# EAGLE schematic sample2 (EAGLE 9.5.0)

## Sheet 1 of 3
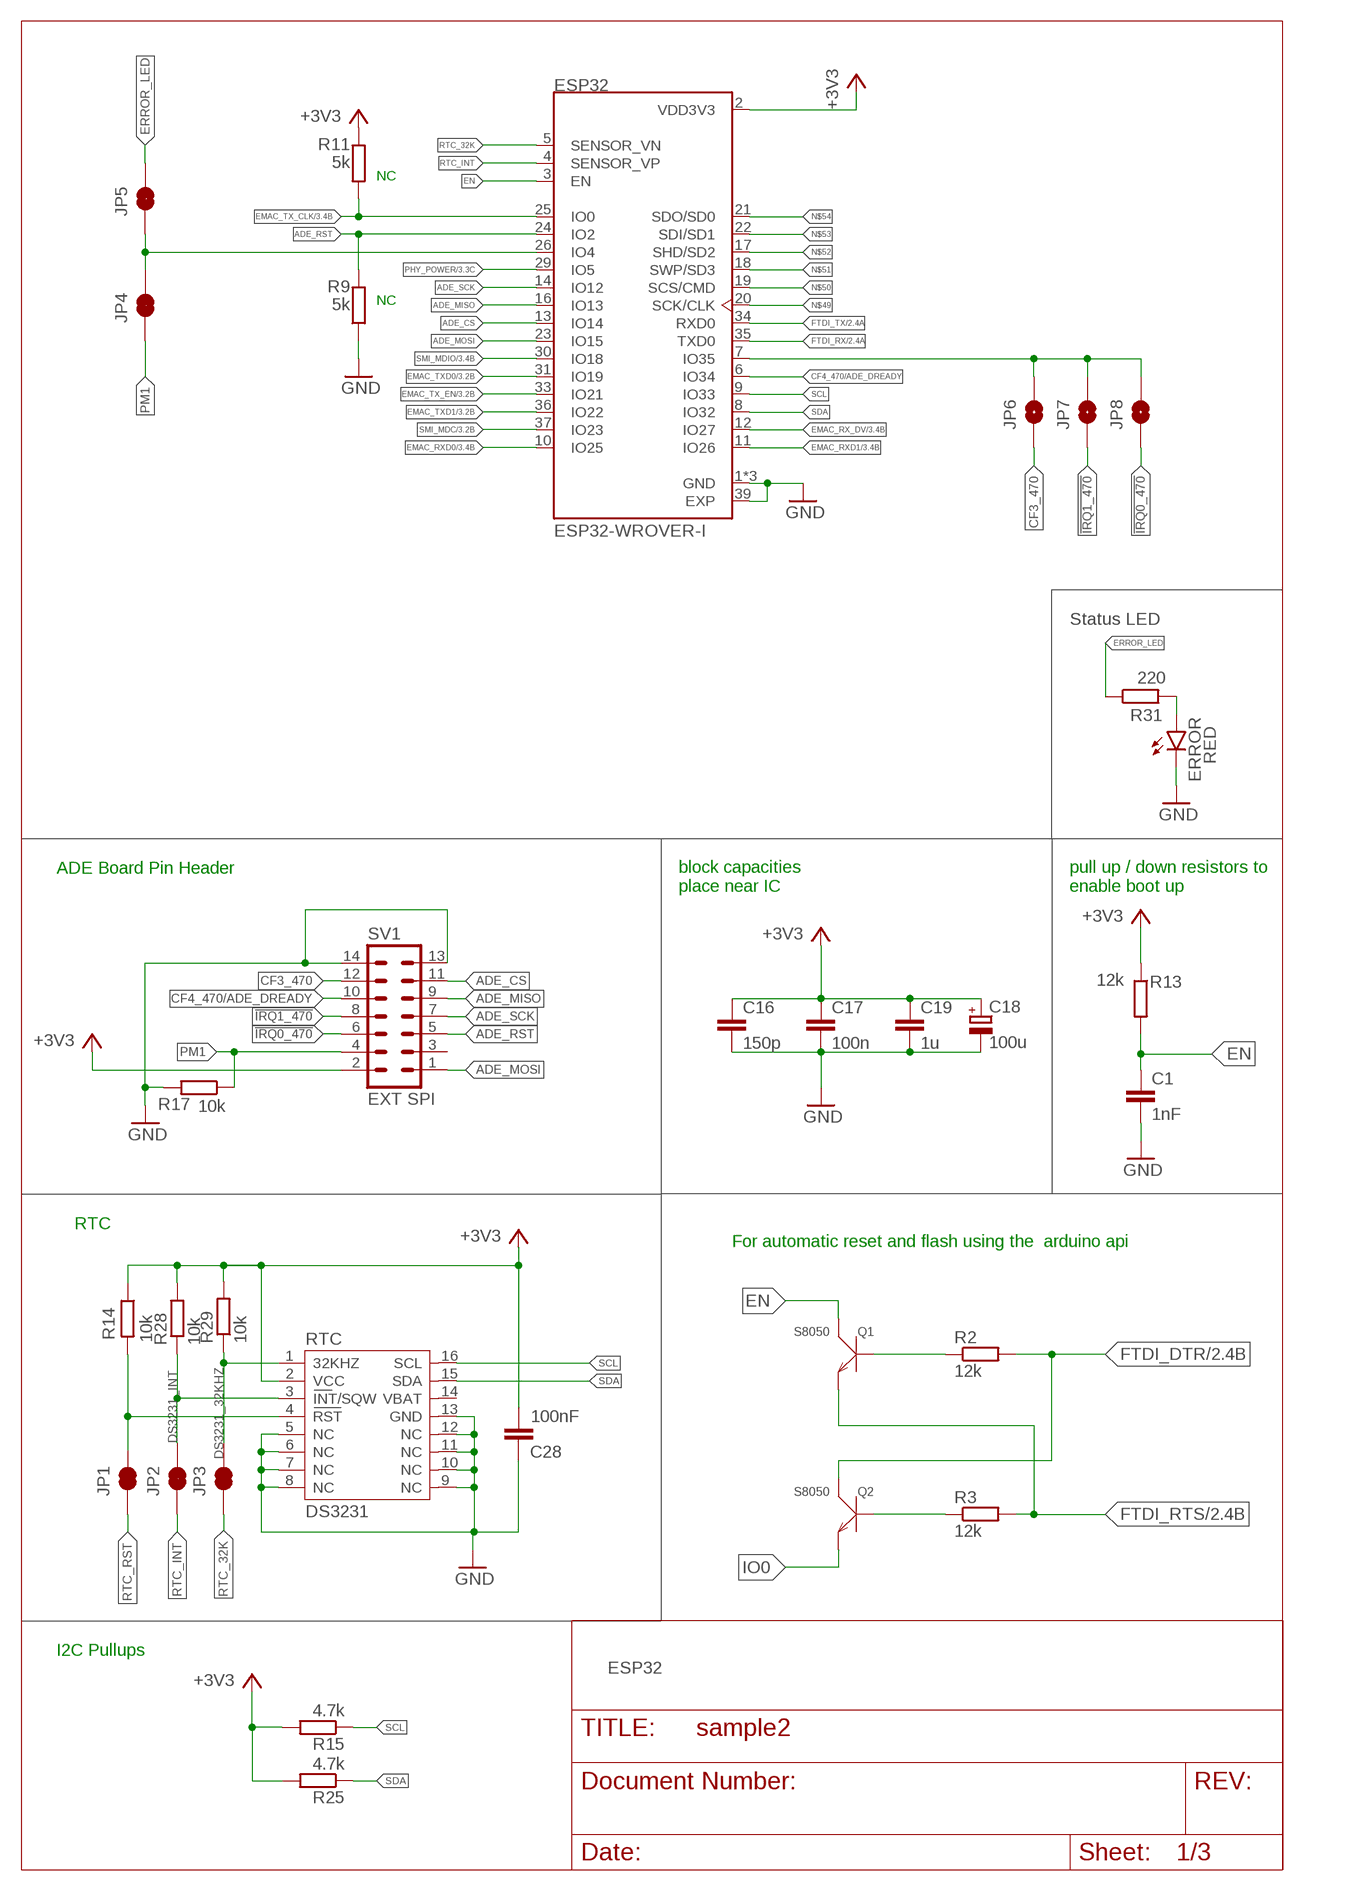
[diagram p0: schematic, sheet 1]

### Parts
C1  1nF  C-EUC0402  [C0402]
C16  150p  C-EUC0402  [C0402]
C17  100n  C-EUC0603  [C0603]
C18  100u  CPOL-EUD/7343-31W  [D/7343-31W]
C19  1u  C-EUC0603  [C0603]
C28  100nF  C-EUC0402  [C0402]
ERROR  RED  LEDCHIP-LED0805  [CHIP-LED0805]
ESP32  ESP32-WROVER-I  [XCVR_ESP32-WROVER-I]
JP1  JUMPER-SMT_2_NC_TRACE_NO-SILK  [SMT-JUMPER_2_NC_TRACE_NO-SILK]
JP2  JUMPER-SMT_2_NC_TRACE_NO-SILK  [SMT-JUMPER_2_NC_TRACE_NO-SILK]
JP3  JUMPER-SMT_2_NC_TRACE_NO-SILK  [SMT-JUMPER_2_NC_TRACE_NO-SILK]
JP4  JUMPER-SMT_2_NC_TRACE_NO-SILK  [SMT-JUMPER_2_NC_TRACE_NO-SILK]
JP5  JUMPER-SMT_2_NC_TRACE_NO-SILK  [SMT-JUMPER_2_NC_TRACE_NO-SILK]
JP6  JUMPER-SMT_2_NO_NO-SILK  [SMT-JUMPER_2_NO_NO-SILK]
JP7  JUMPER-SMT_2_NO_NO-SILK  [SMT-JUMPER_2_NO_NO-SILK]
JP8  JUMPER-SMT_2_NO_NO-SILK  [SMT-JUMPER_2_NO_NO-SILK]
Q1  S8050  SMD-TRANSISTORS-NPN-25V-500MW-S8050(SOT-23)  [SOT-23]
Q2  S8050  SMD-TRANSISTORS-NPN-25V-500MW-S8050(SOT-23)  [SOT-23]
R2  12k  R-EU_R0402  [R0402]
R3  12k  R-EU_R0402  [R0402]
R9  5k  R-EU_R0402  [R0402]
R11  5k  R-EU_R0402  [R0402]
R13  12k  R-EU_R0402  [R0402]
R14  10k  R-EU_R0603  [R0603]
R15  4.7k  R-EU_R0603  [R0603]
R17  10k  R-EU_R0402  [R0402]
R25  4.7k  R-EU_R0603  [R0603]
R28  10k  R-EU_R0603  [R0603]
R29  10k  R-EU_R0603  [R0603]
R31  220  R-EU_R0603  [R0603]
RTC  DS3231  [DS3231]
SV1  EXT SPI  ML14  [ML14]

### Nets
!IRQ0_470: JP8.2 SV1.6
!IRQ1_470: JP7.2 SV1.8
+3V3: C16.1 C17.1 C18.+ C19.1 C28.2 ESP32.2(VDD3V3) R11.1 R13.1 R14.1 R15.2 R25.2 R28.2 R29.2 RTC.2(VCC) SV1.2 ; also sheet 2,3
ADE_CS: ESP32.13(IO14) SV1.11
ADE_MISO: ESP32.16(IO13) SV1.9
ADE_MOSI: ESP32.23(IO15) SV1.1
ADE_RST: ESP32.24(IO2) R9.2 SV1.5
ADE_SCK: ESP32.14(IO12) SV1.7
CF3_470: JP6.1 SV1.12
CF4_470/ADE_DREADY: ESP32.6(IO34) SV1.10
DS3231_32KHZ: JP3.2 R29.1 RTC.1(32KHZ)
DS3231_INT: JP2.2 R28.1 RTC.3(INT/SQW)
DS3231_RST: JP1.2 R14.2 RTC.4(RST)
EMAC_RX_DV: ESP32.12(IO27) ; also sheet 3
EMAC_RXD0: ESP32.10(IO25) ; also sheet 3
EMAC_RXD1: ESP32.11(IO26) ; also sheet 3
EMAC_TX_CLK: ESP32.25(IO0) R11.2 ; also sheet 3
EMAC_TX_EN: ESP32.33(IO21) ; also sheet 3
EMAC_TXD0: ESP32.31(IO19) ; also sheet 3
EMAC_TXD1: ESP32.36(IO22) ; also sheet 3
EN: C1.1 ESP32.3(EN) Q1.3(C) R13.2
ERROR_LED: JP5.2 R31.1
FTDI_DTR: Q2.3(C) R2.2 ; also sheet 2
FTDI_RTS: Q1.2(E) R3.2 ; also sheet 2
FTDI_RX: ESP32.35(TXD0) ; also sheet 2
FTDI_TX: ESP32.34(RXD0) ; also sheet 2
GND: C1.2 C16.2 C17.2 C18.- C19.2 C28.1 ERROR.C ESP32.1(GND) ESP32.15(GND) ESP32.38(GND) ESP32.39(EXP) R9.1 R17.2 RTC.5(NC) RTC.6(NC) RTC.7(NC) RTC.8(NC) RTC.9(NC) RTC.10(NC) RTC.11(NC) RTC.12(NC) RTC.13(GND) SV1.13 SV1.14 ; also sheet 2,3
IO0: Q2.2(E)
N$1: Q1.1(B) R2.1
N$2: Q2.1(B) R3.1
N$13: ESP32.26(IO4) JP4.2 JP5.1
N$16: ERROR.A R31.2
N$29: ESP32.7(IO35) JP6.2 JP7.1 JP8.1
N$49: ESP32.20(SCK/CLK)
N$50: ESP32.19(SCS/CMD)
N$51: ESP32.18(SWP/SD3)
N$52: ESP32.17(SHD/SD2)
N$53: ESP32.22(SDI/SD1)
N$54: ESP32.21(SDO/SD0)
PHY_POWER: ESP32.29(IO5) ; also sheet 3
PM1: JP4.1 R17.1 SV1.4
RTC_32K: ESP32.5(SENSOR_VN) JP3.1
RTC_INT: ESP32.4(SENSOR_VP) JP2.1
RTC_RST: JP1.1
SCL: ESP32.9(IO33) R15.1 RTC.16(SCL)
SDA: ESP32.8(IO32) R25.1 RTC.15(SDA)
SMI_MDC: ESP32.37(IO23) ; also sheet 3
SMI_MDIO: ESP32.30(IO18) ; also sheet 3
Unconnected: RTC.14(VBAT) SV1.3

### Notes on the sheet
- NC
- NC
- Status LED
- ADE Board Pin Header
- block capacities
  place near IC
- pull up / down resistors to
  enable boot up
- RTC
- For automatic reset and flash using the  arduino api
- I2C Pullups
- ESP32

## Sheet 2 of 3
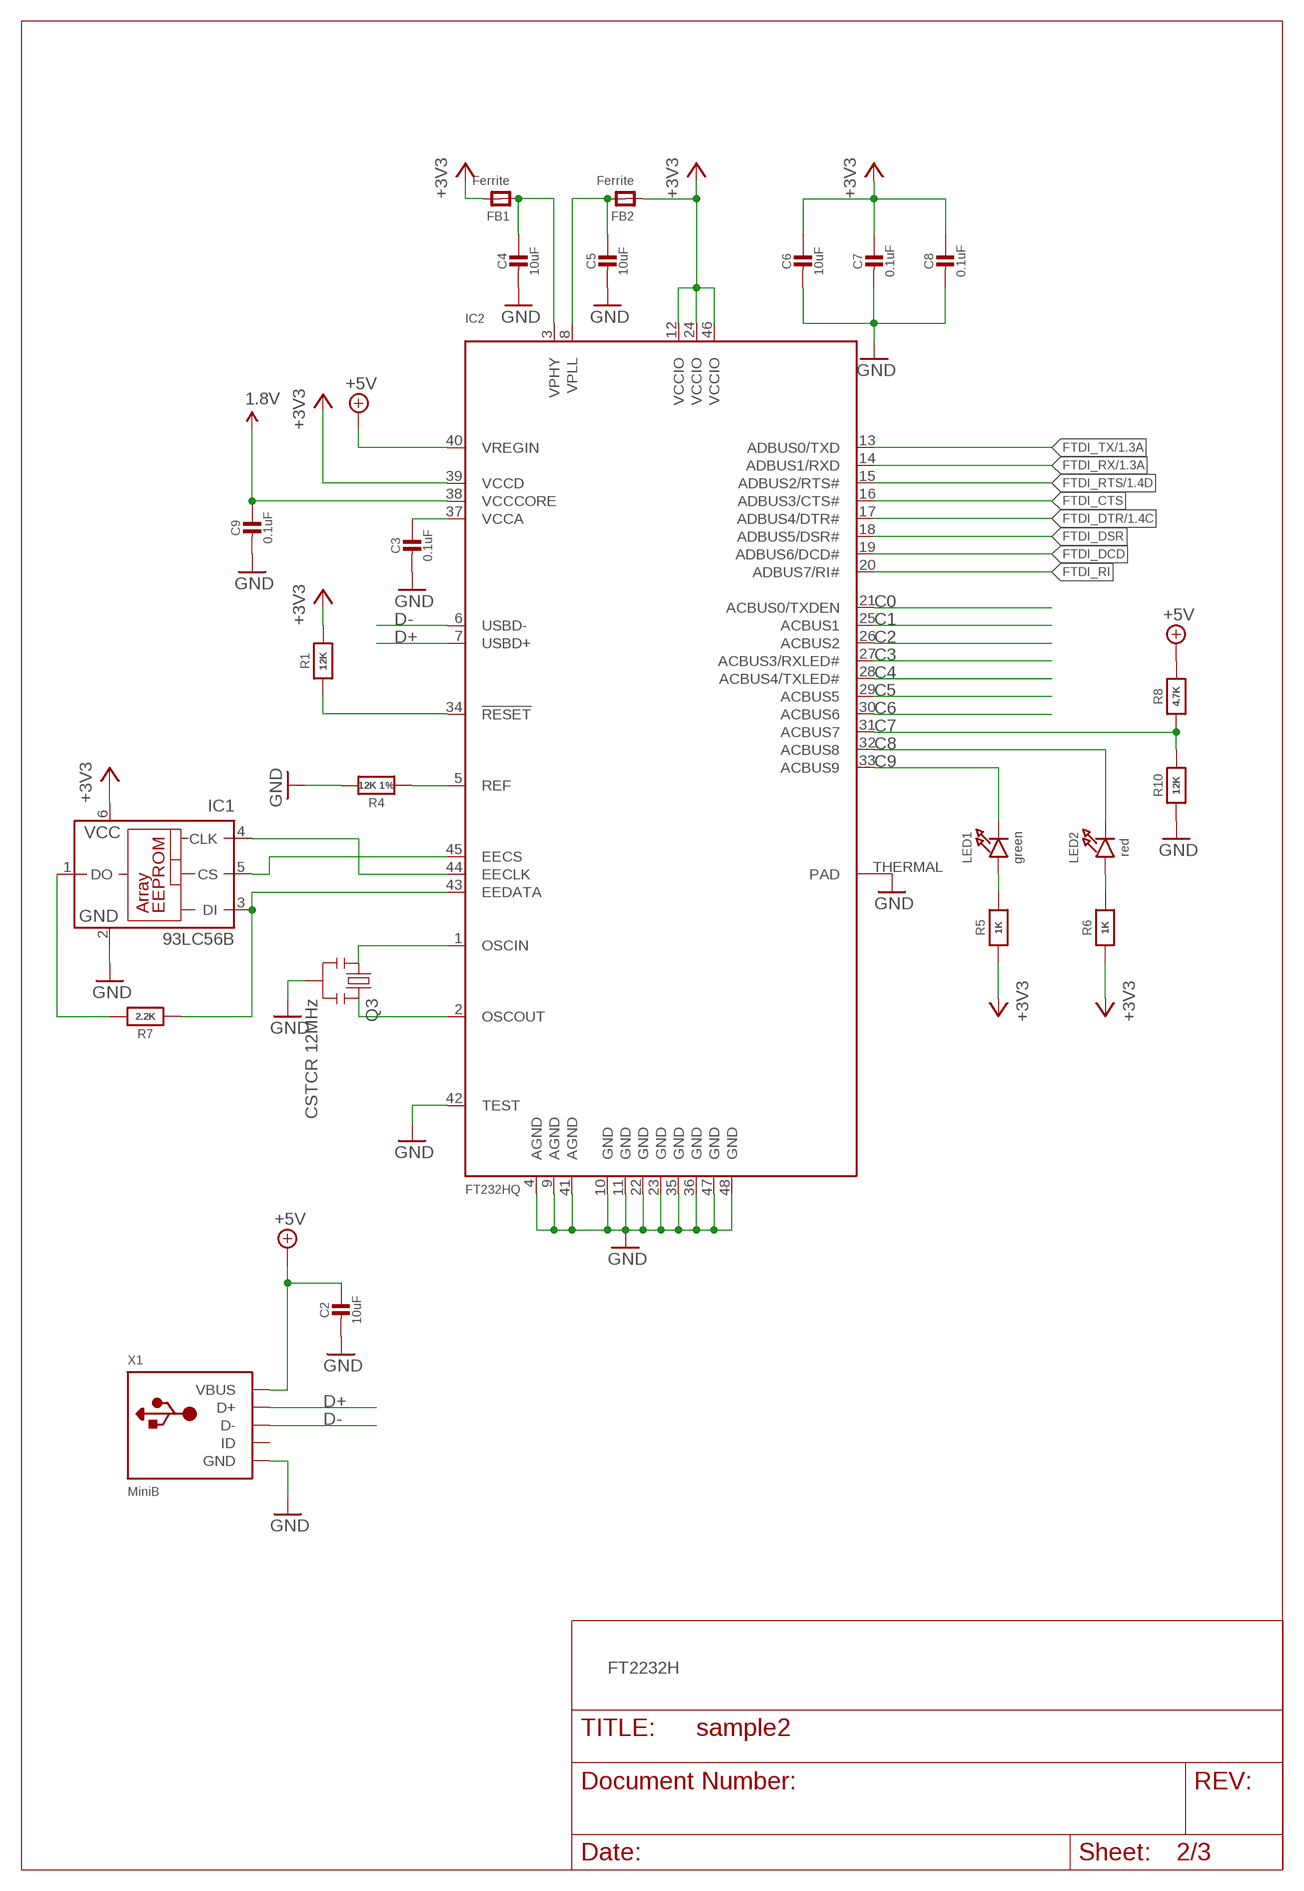
[diagram p1: schematic, sheet 2]

### Parts
C2  10uF  CAP_CERAMIC_0603MP  [_0603MP]
C3  0.1uF  CAP_CERAMIC_0603MP  [_0603MP]
C4  10uF  CAP_CERAMIC_0603MP  [_0603MP]
C5  10uF  CAP_CERAMIC_0603MP  [_0603MP]
C6  10uF  CAP_CERAMIC_0603MP  [_0603MP]
C7  0.1uF  CAP_CERAMIC_0603MP  [_0603MP]
C8  0.1uF  CAP_CERAMIC_0603MP  [_0603MP]
C9  0.1uF  CAP_CERAMIC_0603MP  [_0603MP]
FB1  Ferrite  FERRITE_0603  [_0603]
FB2  Ferrite  FERRITE_0603MP  [_0603MP]
IC1  93LC56B  93LC76A  [SOT23-6]
IC2  FT232HQ  [QFN48_8MM]
LED1  green  LED0603_NOOUTLINE  [CHIPLED_0603_NOOUTLINE]
LED2  red  LED0603_NOOUTLINE  [CHIPLED_0603_NOOUTLINE]
Q3  CSTCR 12MHz  RESONATORSMD  [RESONATOR-SMD]
R1  12K  RESISTOR_0603MP  [_0603MP]
R4  12K 1%  RESISTOR_0603MP  [_0603MP]
R5  1K  RESISTOR_0603MP  [_0603MP]
R6  1K  RESISTOR_0603MP  [_0603MP]
R7  2.2K  RESISTOR_0603MP  [_0603MP]
R8  4.7K  RESISTOR_0603MP  [_0603MP]
R10  12K  RESISTOR_0603MP  [_0603MP]
X1  MiniB  USBMICRO_20329  [4UCONN_20329]

### Nets
1.8V: C9.1 IC2.38(VCCCORE)
+3V3: C6.1 C7.1 C8.1 FB1.2 FB2.1 IC1.6(VCC) IC2.12(VCCIO) IC2.24(VCCIO) IC2.39(VCCD) IC2.46(VCCIO) R1.2 R5.1 R6.1 ; also sheet 1,3
+5V: C2.1 IC2.40(VREGIN) R8.2 X1.VBUS
C0: IC2.21(ACBUS0/TXDEN)
C1: IC2.25(ACBUS1)
C2: IC2.26(ACBUS2)
C3: IC2.27(ACBUS3/RXLED#)
C4: IC2.28(ACBUS4/TXLED#)
C5: IC2.29(ACBUS5)
C6: IC2.30(ACBUS6)
C7: IC2.31(ACBUS7) R8.1 R10.2
C8: IC2.32(ACBUS8) LED2.C
C9: IC2.33(ACBUS9) LED1.C
D+: IC2.7(USBD+) X1.D+
D-: IC2.6(USBD-) X1.D-
FTDI_CTS: IC2.16(ADBUS3/CTS#)
FTDI_DCD: IC2.19(ADBUS6/DCD#)
FTDI_DSR: IC2.18(ADBUS5/DSR#)
FTDI_DTR: IC2.17(ADBUS4/DTR#) ; also sheet 1
FTDI_RI: IC2.20(ADBUS7/RI#)
FTDI_RTS: IC2.15(ADBUS2/RTS#) ; also sheet 1
FTDI_RX: IC2.14(ADBUS1/RXD) ; also sheet 1
FTDI_TX: IC2.13(ADBUS0/TXD) ; also sheet 1
GND: C2.2 C3.2 C4.2 C5.2 C6.2 C7.2 C8.2 C9.2 IC1.2(GND) IC2.4(AGND) IC2.9(AGND) IC2.10(GND) IC2.11(GND) IC2.22(GND) IC2.23(GND) IC2.35(GND) IC2.36(GND) IC2.41(AGND) IC2.42(TEST) IC2.47(GND) IC2.48(GND) IC2.THERMAL(PAD) Q3.2 R4.2 R10.1 X1.BASE@1(GND) X1.BASE@2(GND) X1.GND X1.SPRT@1(GND) X1.SPRT@2(GND) X1.SPRT@3(GND) X1.SPRT@4(GND) ; also sheet 1,3
N$3: IC2.1(OSCIN) Q3.1
N$4: IC2.2(OSCOUT) Q3.3
N$5: IC2.5(REF) R4.1
N$6: LED2.A R6.2
N$7: IC2.34(!RESET) R1.1
N$8: LED1.A R5.2
N$9: IC1.3(DI) IC2.43(EEDATA) R7.1
N$10: IC1.5(CS) IC2.45(EECS)
N$11: IC1.4(CLK) IC2.44(EECLK)
N$12: IC1.1(DO) R7.2
VCCA: C3.1 IC2.37(VCCA)
VPHY: C4.1 FB1.1 IC2.3(VPHY)
VPLL: C5.1 FB2.2 IC2.8(VPLL)
Unconnected: X1.ID

### Notes on the sheet
- FT2232H

## Sheet 3 of 3
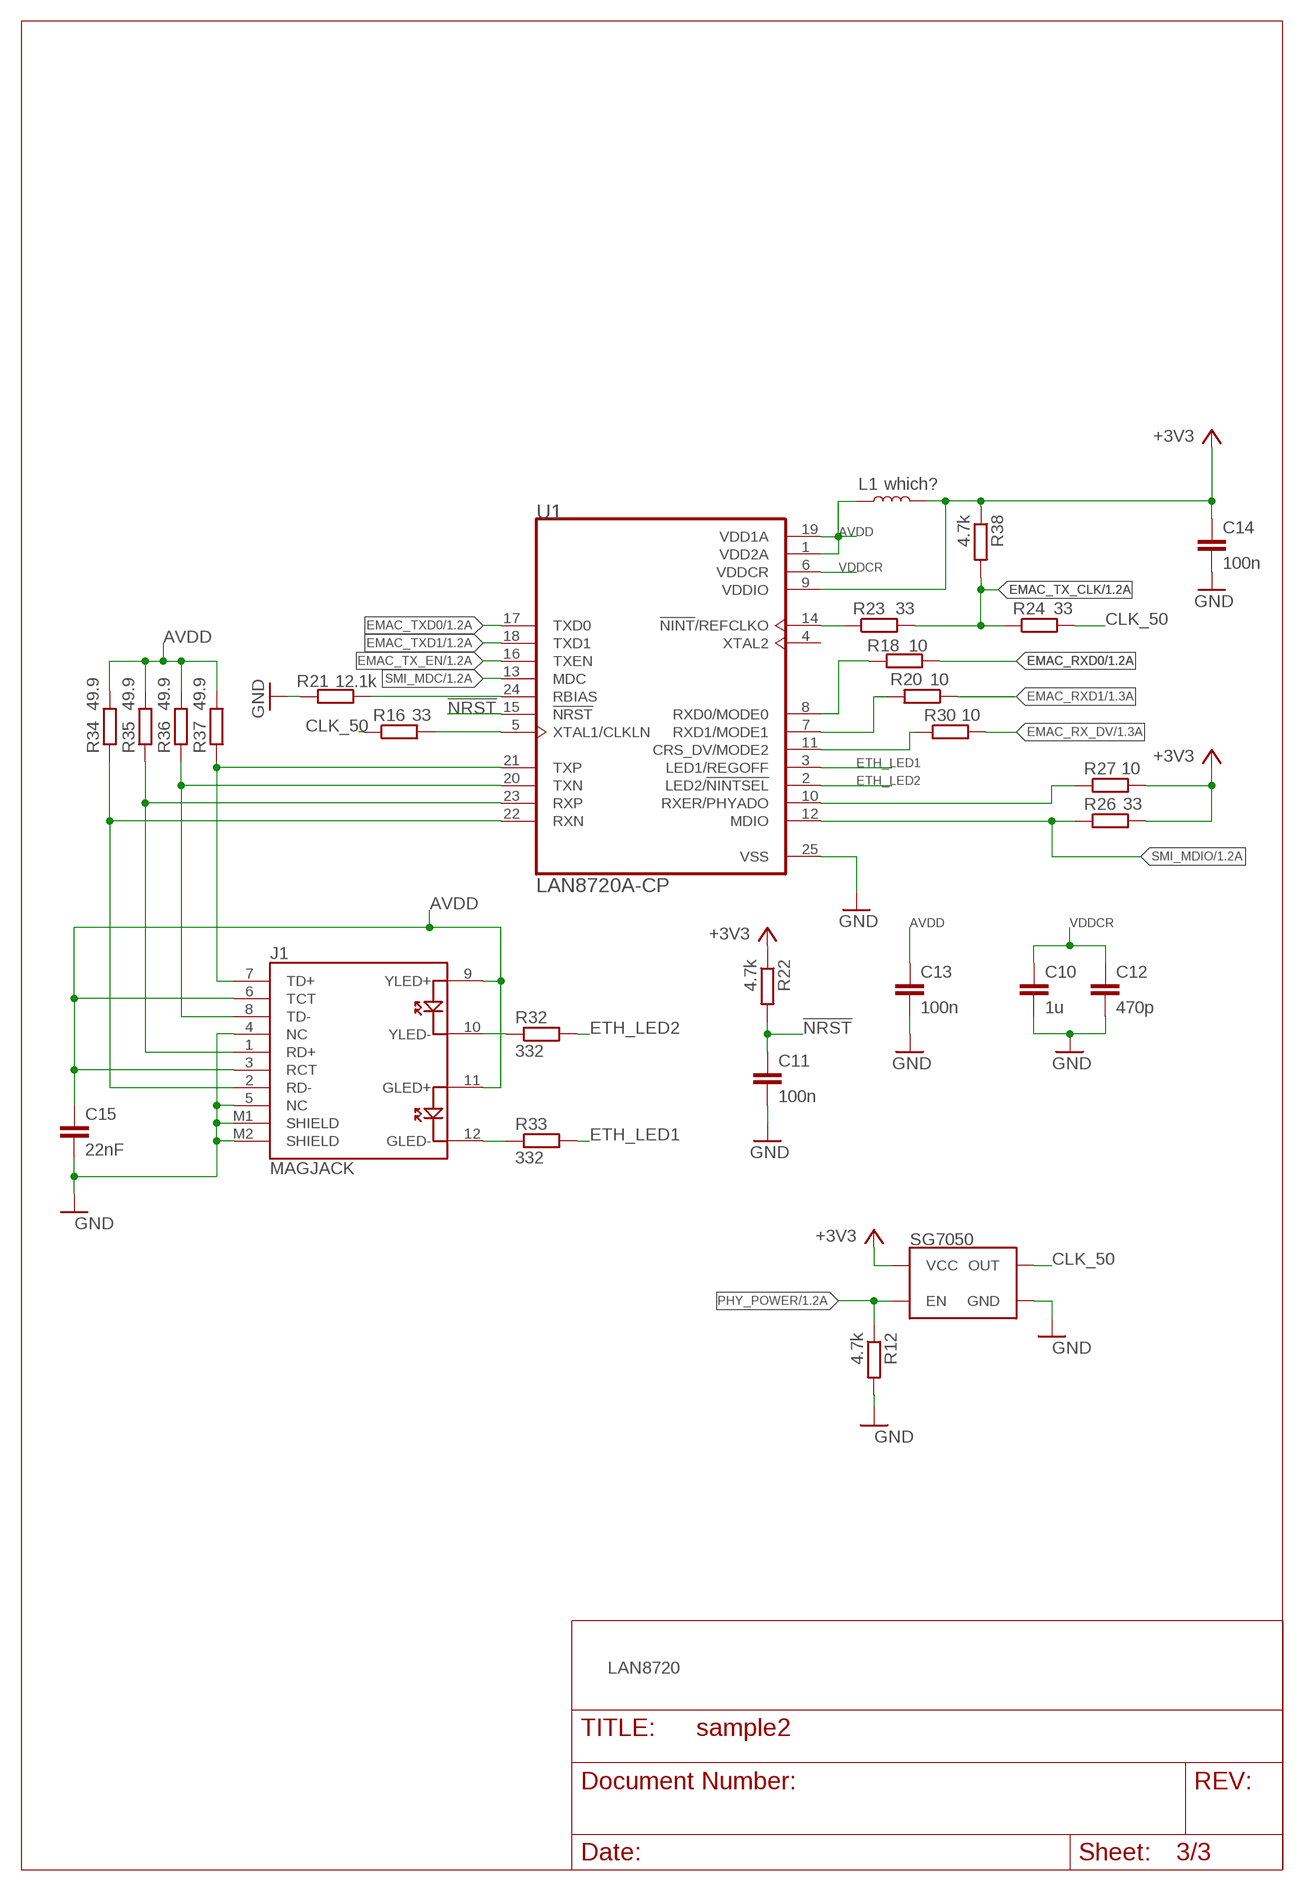
[diagram p2: schematic, sheet 3]

### Parts
C10  1u  C-EUC0402  [C0402]
C11  100n  C-EUC0402  [C0402]
C12  470p  C-EUC0402  [C0402]
C13  100n  C-EUC0402  [C0402]
C14  100n  C-EUC0402  [C0402]
C15  22nF  C-EUC0402  [C0402]
J1  MAGJACK  [MAGJACK]
L1  which?  INDUCTOR-0603-33NH  [0603]
R12  4.7k  R-EU_R0603  [R0603]
R16  33  R-EU_R0603  [R0603]
R18  10  R-EU_R0603  [R0603]
R20  10  R-EU_R0603  [R0603]
R21  12.1k  R-EU_R0603  [R0603]
R22  4.7k  R-EU_R0603  [R0603]
R23  33  R-EU_R0603  [R0603]
R24  33  R-EU_R0603  [R0603]
R26  33  R-EU_R0603  [R0603]
R27  10  R-EU_R0603  [R0603]
R30  10  R-EU_R0603  [R0603]
R32  332  R-EU_R0603  [R0603]
R33  332  R-EU_R0603  [R0603]
R34  49.9  R-EU_R0603  [R0603]
R35  49.9  R-EU_R0603  [R0603]
R36  49.9  R-EU_R0603  [R0603]
R37  49.9  R-EU_R0603  [R0603]
R38  4.7k  R-EU_R0603  [R0603]
SG7050  OSCILLATORSMD-7X5-4PAD  [OSCILLATOR-SMD-7X5-4PAD]
U1  LAN8720A-CP  [QFN50P400X400X100-25N]

### Nets
!NRST: C11.1 R22.2 U1.15(!NRST)
+3V3: C14.1 L1.2 R22.1 R26.2 R27.2 R38.1 SG7050.4(VCC) U1.9(VDDIO) ; also sheet 1,2
AVDD: C13.1 C15.1 J1.3(RCT) J1.6(TCT) J1.9(YLED+) J1.11(GLED+) L1.1 R34.2 R35.2 R36.2 R37.2 U1.1(VDD2A) U1.19(VDD1A)
CLK_50: R16.1 R24.2 SG7050.3(OUT)
EMAC_RX_DV: R30.2 ; also sheet 1
EMAC_RXD0: R18.1 ; also sheet 1
EMAC_RXD1: R20.1 ; also sheet 1
EMAC_TX_CLK: R23.2 R24.1 R38.2 ; also sheet 1
EMAC_TX_EN: U1.16(TXEN) ; also sheet 1
EMAC_TXD0: U1.17(TXD0) ; also sheet 1
EMAC_TXD1: U1.18(TXD1) ; also sheet 1
ETH_LED1: R33.2 U1.3(LED1/REGOFF)
ETH_LED2: R32.2 U1.2(LED2/!NINTSEL!)
GND: C10.2 C11.2 C12.2 C13.2 C14.2 C15.2 J1.4(NC) J1.5(NC) J1.M1(SHIELD) J1.M2(SHIELD) R12.2 R21.2 SG7050.2(GND) U1.25(VSS) ; also sheet 1,2
N$14: R20.2 U1.7(RXD1/MODE1)
N$15: R18.2 U1.8(RXD0/MODE0)
N$17: R21.1 U1.24(RBIAS)
N$18: J1.10(YLED-) R32.1
N$19: R16.2 U1.5(XTAL1/CLKLN)
N$20: R27.1 U1.10(RXER/PHYADO)
N$21: R23.1 U1.14(!NINT!/REFCLKO)
N$22: R30.1 U1.11(CRS_DV/MODE2)
N$23: J1.12(GLED-) R33.1
N$24: J1.7(TD+) R37.1 U1.21(TXP)
N$25: J1.8(TD-) R36.1 U1.20(TXN)
N$26: J1.1(RD+) R35.1 U1.23(RXP)
N$27: J1.2(RD-) R34.1 U1.22(RXN)
PHY_POWER: R12.1 SG7050.1(EN) ; also sheet 1
SMI_MDC: U1.13(MDC) ; also sheet 1
SMI_MDIO: R26.1 U1.12(MDIO) ; also sheet 1
VDDCR: C10.1 C12.1 U1.6(VDDCR)
Unconnected: U1.4(XTAL2)

### Notes on the sheet
- LAN8720

## Library data of the parts
C1 C10-C17 C19 C28 = rcl:C-EU: CAPACITOR, European symbol; SPICEPREFIX: C
C2-C9 = microbuilder:CAP_CERAMIC: Ceramic Capacitors For new designs, use the packages preceded by an '_' character since they are more reliable: The following footprints should be used on most boards: _0402 - Standard footprint for regular board layouts _0603 - Standard footprint for regular board layouts _0805 - Standard footprint for regular board layouts _1206 - Standard footprint for regular board layouts For extremely tight-pitch boards where space is at a premium, the following 'micro-pitch' footprints can be used (smaller pads, no silkscreen outline, etc.): _0402MP - Micro-pitch footprint for very dense/compact boards _0603MP - Micro-pitch footprint for very dense/compact boards _0805MP - Micro-pitch footprint for very dense/compact boards _1206MP - Micro-pitch footprint for very dense/compact boards
C18 = rcl:CPOL-EU: POLARIZED CAPACITOR, European symbol; SPICEPREFIX: C
ERROR = led:LED: LED
ESP32 = ESP32-WROVER-I:ESP32-WROVER-I: Module: combo; GPIO, I2C x2, I2S x2, SDIO, SPI x3, UART x3; U.FL; AVAILABILITY: Unavailable; DESCRIPTION: Module: combo; GPIO, I2C x2, I2S x2, SDIO, SPI x3, UART x3; U.FL; MF: Espressif Systems; MP: ESP32-WROVER-I; PACKAGE: Module Espressif Systems; PRICE: None
FB1 FB2 = microbuilder:FERRITE: Ferrite Bead 0603 MMZ1608B121C - 120 Ohm @ 100MHz, 600mA, 0.15 Ohm DC Resistance - Digikey: 445-2164-1-ND BK1608HW121-T - 120 Ohm, 600mA Ferrite Chip - Digikey: 587-1876-2-ND 0805 HZ0805B272R-10 - 2.7K Ohm @ 100MHz, 200mA, 0.8 Ohm DC Resistance - Digikey: 240-2504-1-ND (see also Murata BLM21BD272SN1L) MMZ2012Y152B - 1.5K Ohm @ 100MHz, 500mA, 0.4 Ohm DC Resistance - Digikey: 445-1560-1-ND - Mainly for high frequency (80-400MHz) MMZ2012R102A - 1K Ohm @ 100MHz, 500mA, 0.3 Ohm DC Resistance - Digikey: 445-1555-2-ND - More general purpose (10-200MHz)
IC1 = microchip:93*76?: 8K Microwire Compatible Serial EEPROM Source: http://ww1.microchip.com/downloads/en/DeviceDoc/21796H.pdf; MF: MICROCHIP; MPN: 93LC76AT-I/OT; OC_FARNELL: 1556170; OC_NEWARK: 61H6824
IC2 = microbuilder:FT232H
J1 = SparkFun-Connectors:MAGJACK: MAGJACK: RJ-45 with LEDs This is a single port, RJ45 ethernet jacks with built in transformer (magnetics), status LEDs, and shielding. Here is the connector we sell at SparkFun: RJ45 Ethernet MagJack-Compatible <https://www.sparkfun.com/products/8534> (PRT-08534) Datasheet <http://www.sparkfun.com/datasheets/Prototyping/MagJack.pdf> It is used on this SparkFun product: SparkFun RJ45 MagJack Breakout <https://www.sparkfun.com/products/13021> (BOB-13021); PROD_ID: CONN-09556; SF_ID: PRT-08534
JP1-JP5 = SparkFun-Jumpers:JUMPER-SMT_2_NC_TRACE: Normally closed trace jumper This jumper has a trace between two pads so it's normally closed (NC). Use a razor knife to open the connection. For best results follow the IPC guidelines for cutting traces: Cutout at least 0.063 mm (0.005 in). Remove all loose material to clean up the cut area. Seal the cut with an approved epoxy. Reapply solder to reclose the connection.
JP6-JP8 = SparkFun-Jumpers:JUMPER-SMT_2_NO: Normally open jumper This jumper has two pads in close proximity to each other. Apply solder to close the connection. Round pads are easier to solder for beginners, but are a lot larger. SparkFun Product that uses the round pads: SparkFun EL Sequencer <https://www.sparkfun.com/products/12781>
L1 = SparkFun-Coils:INDUCTOR: Inductors Resist changes in electrical current. Basically a coil of wire. SparkFun Products: SparkFun Load Cell Amplifier - HX711 <https://www.sparkfun.com/products/13879> IOIO-OTG - V2.2 <https://www.sparkfun.com/products/13613>; PROD_ID: NDUC-07874; VALUE: 33nH/±5%/500mA
LED1 LED2 = microbuilder:LED: LED
Q1 Q2 = Seeed-Transistor:SMD-TRANSISTORS-NPN-25V-500MW-S8050(SOT-23): 305010017; MPN: S8050
Q3 = SparkFun:RESONATOR: Resonator Small SMD resonator. This is the itty bitty 10/20MHz resonators with built in caps. CSTCE10M0G55 and CSTCE20M0V53. Footprint has been reviewed closely but hasn't been tested yet.
R1 R4-R8 R10 = microbuilder:RESISTOR: Resistors For new designs, use the packages preceded by an '_' character since they are more reliable: The following footprints should be used on most boards: _0402 - Standard footprint for regular board layouts _0603 - Standard footprint for regular board layouts _0805 - Standard footprint for regular board layouts _1206 - Standard footprint for regular board layouts For extremely tight-pitch boards where space is at a premium, the following 'micro-pitch' footprints can be used (smaller pads, no silkscreen outline, etc.): _0402MP - Micro-pitch footprint for very dense/compact boards _0603MP - Micro-pitch footprint for very dense/compact boards _0805MP - Micro-pitch footprint for very dense/compact boards _1206MP - Micro-pitch footprint for very dense/compact boards
R2 R3 R9 R11-R18 R20-R38 = resistor:R-EU_: RESISTOR, European symbol
RTC = _lh-library:DS3231
SG7050 = SparkFun-Clocks:OSCILLATOR: Oscillators (Generic) These are active oscillators, which require a power source to generate their clock output. Most oscillators are configured to generate a set frequency (e.g. 16MHz). They have four pins: power, ground, output, and an enable input.
SV1 = con-harting-ml:ML14: HARTING; OC_FARNELL: unknown; OC_NEWARK: unknown
U1 = LAN8720A-CP:LAN8720A-CP: LAN8720A Series 3.3 V RMII 10/100 Ethernet Transceiver Surface Mount - QFN-24; AVAILABILITY: Unavailable; DESCRIPTION: LAN8720A Series 3.3 V RMII 10/100 Ethernet Transceiver Surface Mount - QFN-24; MF: Microchip; MP: LAN8720A-CP; PACKAGE: QFN-24 Microchip; PRICE: None
X1 = microbuilder:USB: USB Connectors USBMINIB - Surface Mount Female Mini-B USB Connector 4UConnector: 06564